# EasyEDA Pro project charging-dock-10.eprj

# Schematic 10 Tracker Charging Dock
Board Name: 10 Tracker Charging Dock; Create Date: 2026-08-09; Page Name: Dock-10; Project Name: charging-dock-10; Schematic Name: 10 Tracker Charging Dock; Update Date: 2026-09-15; Company: puppy sky; Page Size: A4; Version: paw-1
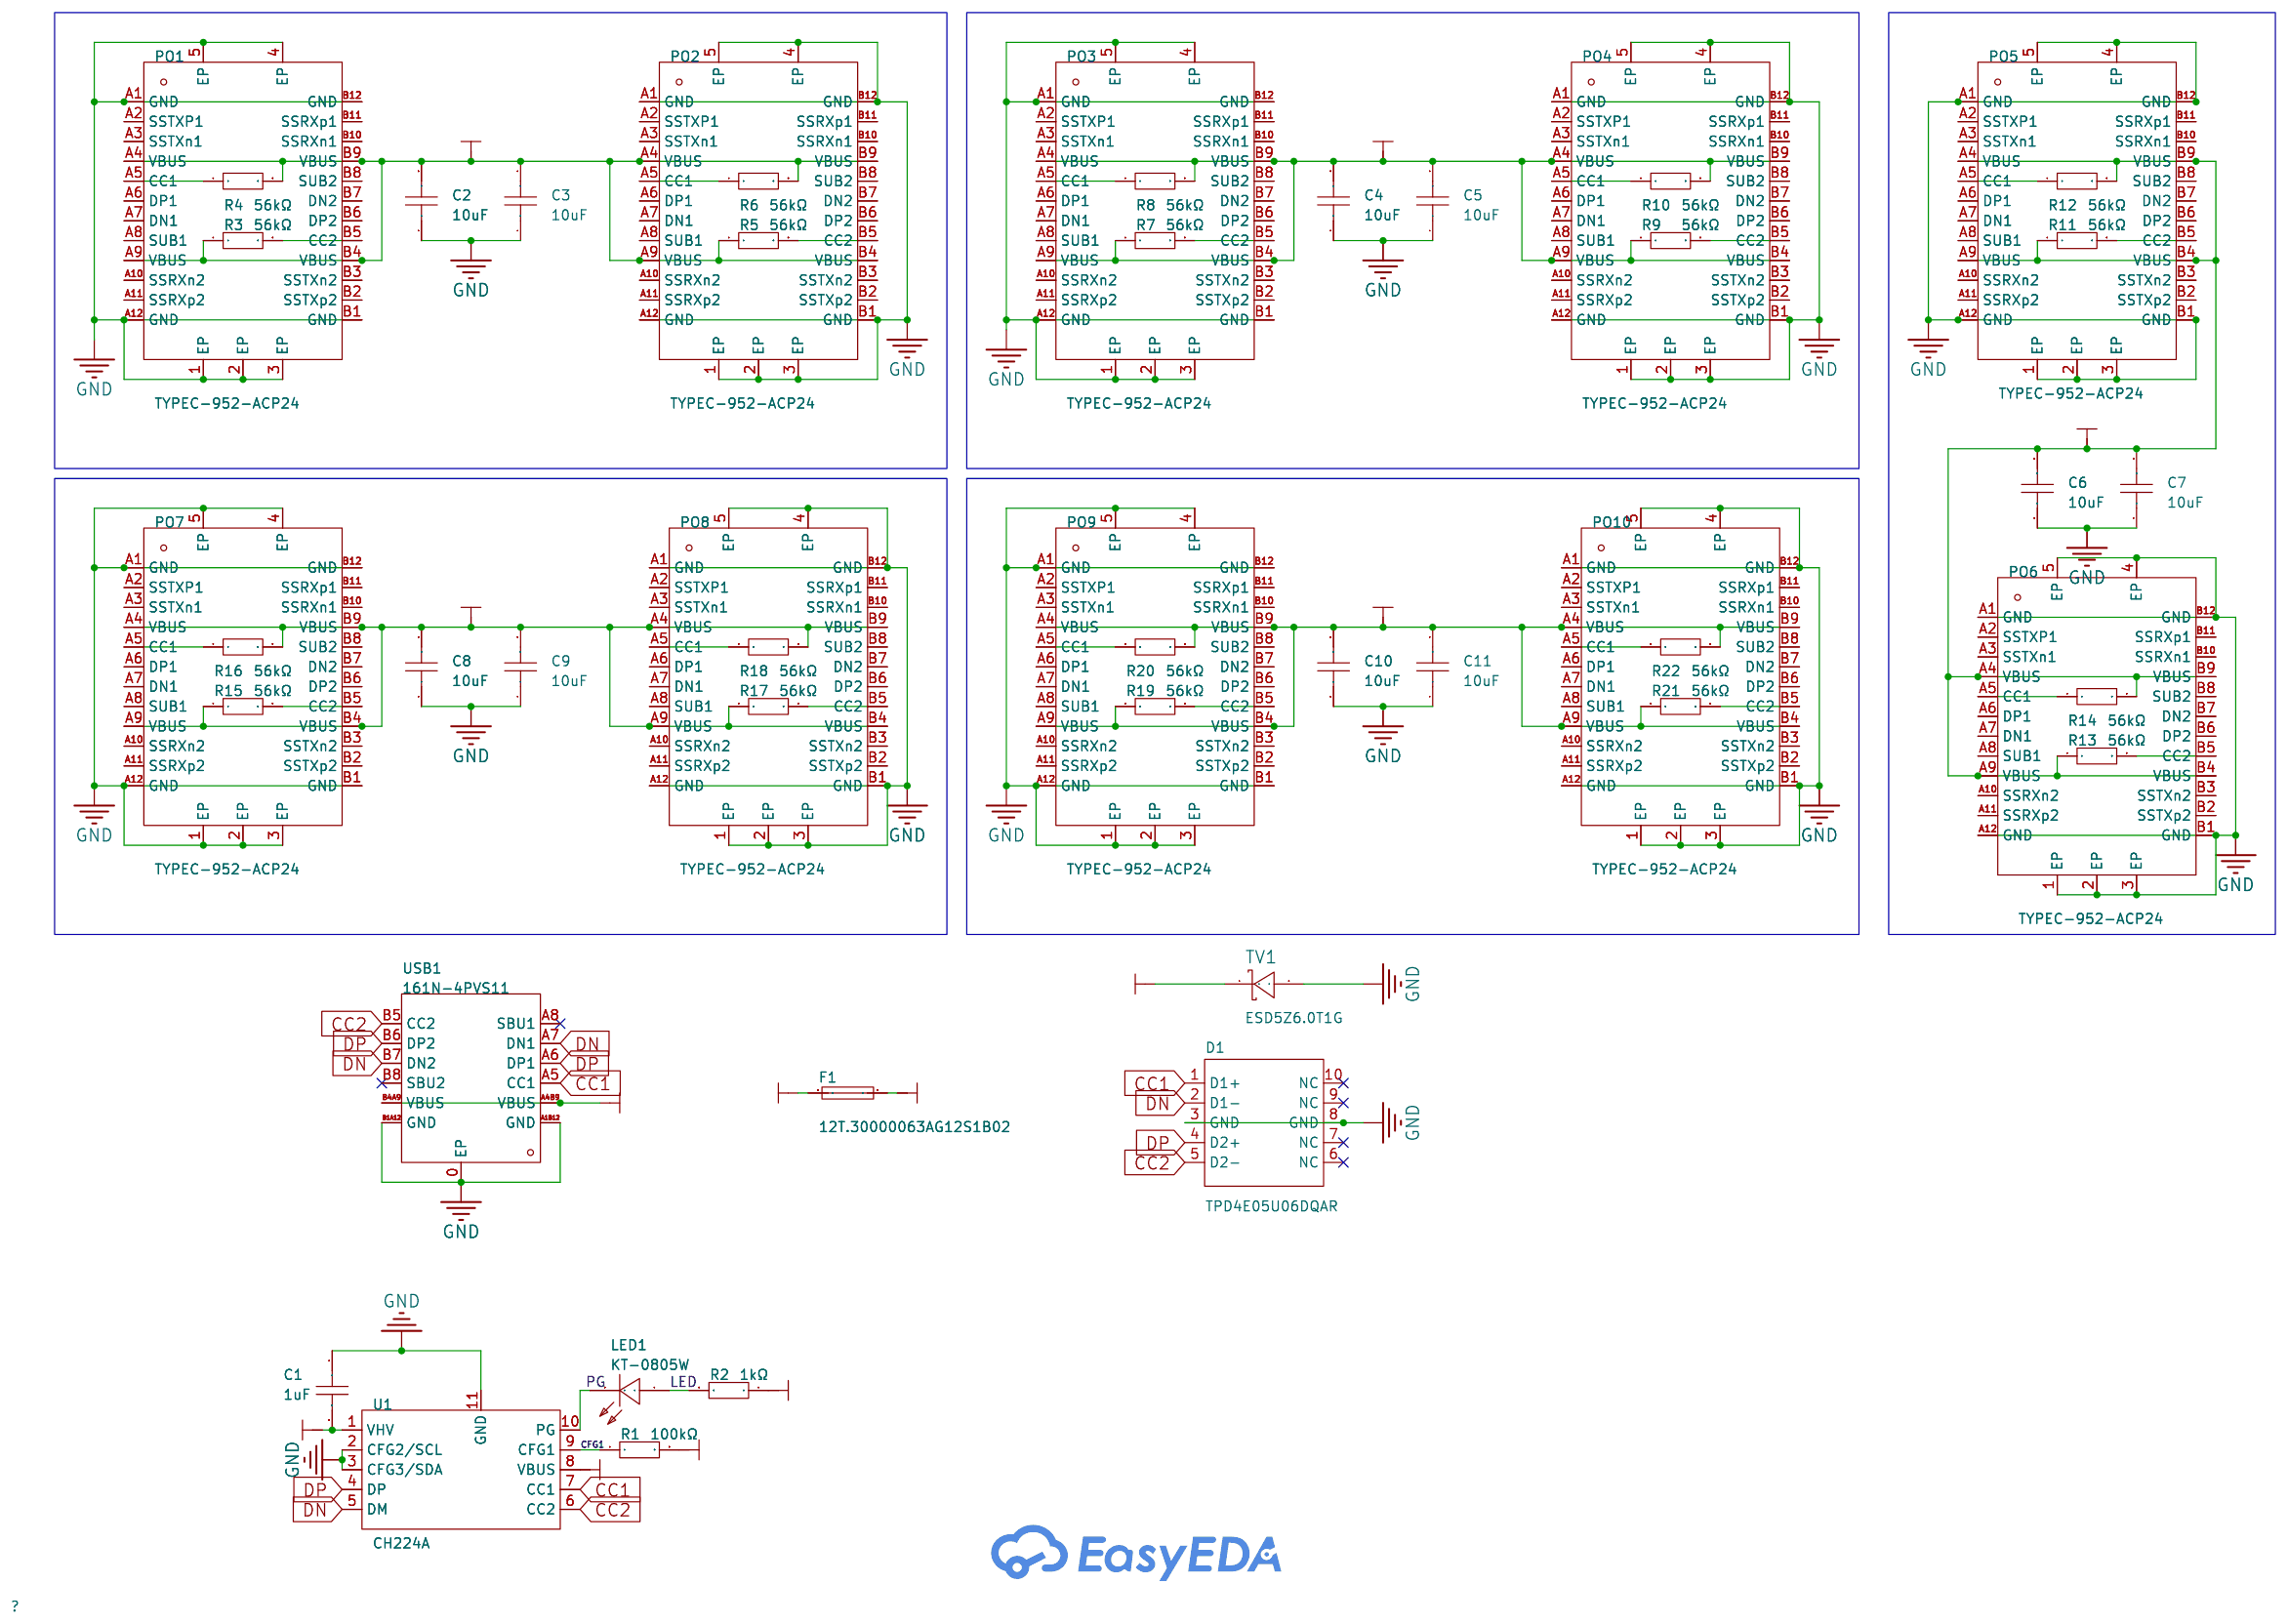
[diagram p0: schematic sheet]

## Parts
C1  1uF  [C0603]
C2  10uF  [C0805]
C3  10uF  [C0805]
C4  10uF  [C0805]
C5  10uF  [C0805]
C6  10uF  [C0805]
C7  10uF  [C0805]
C8  10uF  [C0805]
C9  10uF  [C0805]
C10  10uF  [C0805]
C11  10uF  [C0805]
D1  TPD4E05U06DQAR  [USON-10_L2.5-W1.0-P0.50-BL]
F1  12T.30000063AG12S1B02  [F1206]
LED1  KT-0805W  [LED0805-R-RD]
PO1  TYPEC-952-ACP24  [USB-C-SMD_TYPEC-952-ACP24]
PO2  TYPEC-952-ACP24  [USB-C-SMD_TYPEC-952-ACP24]
PO3  TYPEC-952-ACP24  [USB-C-SMD_TYPEC-952-ACP24]
PO4  TYPEC-952-ACP24  [USB-C-SMD_TYPEC-952-ACP24]
PO5  TYPEC-952-ACP24  [USB-C-SMD_TYPEC-952-ACP24]
PO6  TYPEC-952-ACP24  [USB-C-SMD_TYPEC-952-ACP24]
PO7  TYPEC-952-ACP24  [USB-C-SMD_TYPEC-952-ACP24]
PO8  TYPEC-952-ACP24  [USB-C-SMD_TYPEC-952-ACP24]
PO9  TYPEC-952-ACP24  [USB-C-SMD_TYPEC-952-ACP24]
PO10  TYPEC-952-ACP24  [USB-C-SMD_TYPEC-952-ACP24]
R1  100kΩ  [R0603]
R2  1kΩ  [R0603]
R3  56kΩ  [R0603]
R4  56kΩ  [R0603]
R5  56kΩ  [R0603]
R6  56kΩ  [R0603]
R7  56kΩ  [R0603]
R8  56kΩ  [R0603]
R9  56kΩ  [R0603]
R10  56kΩ  [R0603]
R11  56kΩ  [R0603]
R12  56kΩ  [R0603]
R13  56kΩ  [R0603]
R14  56kΩ  [R0603]
R15  56kΩ  [R0603]
R16  56kΩ  [R0603]
R17  56kΩ  [R0603]
R18  56kΩ  [R0603]
R19  56kΩ  [R0603]
R20  56kΩ  [R0603]
R21  56kΩ  [R0603]
R22  56kΩ  [R0603]
TV1  ESD5Z6.0T1G  [SOD-523F_L1.2-W0.8-LS1.7-RD]
U1  CH224A  [ESSOP-10_L4.9-W3.9-P1.0-LS6.0-TL-EP]
USB1  161N-4PVS11  [USB-C-SMD_HANELECTRICITY_161N-4XVS11]

## Library data of the parts
C1 = CL10A105KB8NNNC: Capacitance: Tolerance:±10% Tolerance:±10% Voltage Rated: Temperature Coefficient:; LCSC Part Name: 1uF ±10% 50V; Supplier Part: C15849; Manufacturer: SAMSUNG(三星); Supplier Footprint: 0603; JLCPCB Part Class: Basic Part; Datasheet: https://atta.szlcsc.com/upload/public/pdf/source/20160218/1457707763339.pdf; Supplier: LCSC; Tolerance: ±10%
C2-C11 = CL21A106KAYNNNE_C15850: Capacitance: Tolerance:±10% Tolerance:±10% Voltage Rated: Temperature Coefficient:; LCSC Part Name: 10uF ±10% 25V; Supplier Part: C15850; Manufacturer: SAMSUNG(三星); Manufacturer Part: CL21A106KAYNNNE; Supplier Footprint: 0805; JLCPCB Part Class: Basic Part; Datasheet: https://atta.szlcsc.com/upload/public/pdf/source/20160218/1457707763339.pdf; Supplier: LCSC; Tolerance: ±10%
D1 = TPD4E05U06DQAR_C138714: LCSC Part Name: 单向TVS 5.5V截止 峰值脉冲电流：2.5A@8/20us; Supplier Part: C138714; Manufacturer: TI(德州仪器); Supplier Footprint: USON-10(1x2.5); JLCPCB Part Class: Extended Part; Datasheet: https://www.ti.com/cn/lit/ds/symlink/tpd4e05u06.pdf; Supplier: LCSC; Polarity: Unidirectional; Reverse Stand-Off Voltage (Vrwm): 5.5V; Clamping Voltage: 14V; Peak Pulse Current (Ipp): 2.5A@8/20us; Peak Pulse Power Dissipation (Ppp): 40W@8/20us; Voltage - Breakdown: 6.5V; Reverse Leakage Current (Ir): 10nA; Number of Channels: Four channels; Operating Temperature: -40℃~+125℃; level of protection: IEC 61000-4-4；IEC 61000-4-5；IEC 61000-4-2; Type: ESD; Junction Capacitance: 0.5pF
F1 = 12T.30000063AG12S1B02: Type:SMD Fuse Current Rating:3A Voltage Rating (DC):63V Operating Temperature:-55℃~+125℃ Operating Temperature:-55℃~+125℃ Interrupt Rating:50A; LCSC Part Name: 贴片式保险丝; Supplier Part: C140478; Manufacturer: xcfuse(旭程); Supplier Footprint: 1206; JLCPCB Part Class: Extended Part; Datasheet: https://atta.szlcsc.com/upload/public/pdf/source/20180423/C140482_0BFCB1E2582598C0CD6C9793BBCA88DB.pdf; Supplier: LCSC; Type: SMD Fuse; Current Rating: 3A; Voltage Rating (DC): 63V; Operating Temperature: -55℃~+125℃; Interrupt Rating: 50A
LED1 = KT-0805W: LCSC Part Name: 0805 白灯 高亮; Supplier Part: C34499; Manufacturer: KENTO; Supplier Footprint: 0805; JLCPCB Part Class: Basic Part; Datasheet: https://atta.szlcsc.com/upload/public/pdf/source/20221124/DAA20402FFC1FB071B8B6797757426FE.pdf; Supplier: LCSC
PO1-PO10 = TYPEC-952-ACP24: Connector Type:Type-C Protocol Standard:USB 3.1 Gender:Male Mounting Type:Surface Mount,Vertical Number of Contacts:24P Number of Ports:1 Current Rating-Power:5A Voltage Rating:5V Connect-Disconnect Life:10000 times Length:11.1mm Detection color:Black Ope; LCSC Part Name: Type-C 公 立贴; Supplier Part: C2840398; Manufacturer: XUNPU(讯普); Supplier Footprint: SMD; JLCPCB Part Class: Extended Part; Datasheet: https://item.szlcsc.com/datasheet/TYPEC-952-ACP24/3018861.html; Supplier: LCSC; Connector Type: Type-C; Protocol Standard: USB 3.1; Gender: Male; Mounting Type: Surface Mount,Vertical; Number of Contacts: 24P; Number of Ports: 1; Current Rating-Power: 5A; Voltage Rating: 5V; Connect-Disconnect Life: 10000 times; Length: 11.1mm; Detection color: Black; Operating Temperature: -45℃~+85℃
R1 = 0603WAF1003T5E: Type:Thick Film Resistor Resistance:100kΩ Tolerance:±1% Tolerance:±1% Power(Watts):100mW Voltage-Supply(Max):75V Temperature Coefficient:±100ppm/℃ Temperature Coefficient:±100ppm/℃ Operating Temperature:-55℃~+155℃ Operating Temperature:-55℃~+155℃; LCSC Part Name: 厚膜电阻 100kΩ ±1%; Supplier Part: C25803; Manufacturer: UNI-ROYAL(厚声); Supplier Footprint: 0603; JLCPCB Part Class: Basic Part; Datasheet: https://item.szlcsc.com/datasheet/0603WAF1003T5E/26546.html; Supplier: LCSC; Type: Thick Film Resistor; Tolerance: ±1%; Power(Watts): 100mW; Voltage-Supply(Max): 75V; Temperature Coefficient: ±100ppm/℃; Operating Temperature: -55℃~+155℃
R2 = 0603WAF1001T5E: Type:Thick Film Resistors Resistance:1kΩ Tolerance:±1% Tolerance:±1% Power(Watts): Overload Voltage (Max): Temperature Coefficient:±100ppm/℃ Temperature Coefficient:±100ppm/℃ Operating Temperature Range:-55℃~+155℃ Operating Temperature Range:-55℃~+155℃; LCSC Part Name: 1kΩ ±1% 100mW 厚膜电阻; Supplier Part: C21190; Manufacturer: UNI-ROYAL(厚声); Supplier Footprint: 0603; JLCPCB Part Class: Basic Part; Datasheet: https://atta.szlcsc.com/upload/public/pdf/source/20200306/C422600_1E6D84923E4A46A82E41ADD87F860B5C.pdf; Supplier: LCSC; Type: Thick Film Resistors; Tolerance: ±1%; Temperature Coefficient: ±100ppm/℃; Operating Temperature Range: -55℃~+155℃
R3-R22 = 0603WAF5602T5E: Type:Thick Film Resistor Resistance:56kΩ Tolerance:±1% Tolerance:±1% Power(Watts):100mW Voltage-Supply(Max):75V Temperature Coefficient:±100ppm/℃ Temperature Coefficient:±100ppm/℃ Operating Temperature:-55℃~+155℃ Operating Temperature:-55℃~+155℃; LCSC Part Name: 56kΩ ±1% 100mW 厚膜电阻; Supplier Part: C23206; Manufacturer: UNI-ROYAL(厚声); Supplier Footprint: 0603; JLCPCB Part Class: Basic Part; Datasheet: https://item.szlcsc.com/datasheet/0603WAF5602T5E/23933.html; Supplier: LCSC; Type: Thick Film Resistor; Tolerance: ±1%; Power(Watts): 100mW; Voltage-Supply(Max): 75V; Temperature Coefficient: ±100ppm/℃; Operating Temperature: -55℃~+155℃
TV1 = ESD5Z6.0T1G: LCSC Part Name: 单向ESD 6V截止 峰值脉冲电流：8.8A; Supplier Part: C82323; Manufacturer: onsemi(安森美); Supplier Footprint: SOD-523; JLCPCB Part Class: Extended Part; Datasheet: https://item.szlcsc.com/datasheet/ESD5Z6.0T1G/83480.html; Supplier: LCSC; Polarity: Unidirectional; Reverse Stand-Off Voltage (Vrwm): 6V; Clamping Voltage: 12.4V; Peak Pulse Current (Ipp): 8.8A; Peak Pulse Power Dissipation (Ppp): 181W@8/20us; Voltage - Breakdown: 6.8V; Reverse Leakage Current (Ir): 10nA; Number of Channels: 1; Operating Temperature: -55℃~+150℃; level of protection: IEC 61000-4-4；IEC 61000-4-2; Type: ESD; Junction Capacitance: 70pF
U1 = CH224A: Type:Power Receiver Controller Output Power:140W Output Voltage:5V；20V；15V；12V；28V；9V Operating Temperature:-40℃~+105℃ Operating Temperature:-40℃~+105℃; Supplier Part: C42459160; Manufacturer: WCH(南京沁恒); Supplier Footprint: ESSOP-10; JLCPCB Part Class: Extended Part; Datasheet: https://item.szlcsc.com/datasheet/CH224A/44538670.html; Supplier: LCSC; Type: Power Receiver Controller; Output Power: 140W; Output Voltage: 5V；20V；15V；12V；28V；9V; Operating Temperature: -40℃~+105℃
USB1 = 161N-4PVS11: LCSC Part Name: Type-C 母 卧贴; Supplier Part: C5440757; Manufacturer: HanElectricity(瀚源); Supplier Footprint: 插件; JLCPCB Part Class: Extended Part; Datasheet: https://item.szlcsc.com/datasheet/161N-4PVS11/6323622.html; Supplier: LCSC; Connector Type: Type-C; Gender: Female; Mounting Type: Surface Mount, Right Angle; Number of Contacts: 16P; Number of Ports: 1; Current Rating-Power: 3A; Connect-Disconnect Life: 10,000 cycles; Length: 7.3mm; Detection color: Purple; Operating Temperature: -55℃~+85℃

## Nets
GND: C1.1 C2.1 C3.1 C4.1 C5.1 C6.1 C7.1 C8.1 C9.1 C10.1 C11.1 D1.3(GND) D1.8(GND) PO1.1(EP) PO1.2(EP) PO1.3(EP) PO1.4(EP) PO1.5(EP) PO1.A1(GND) PO1.A12(GND) PO1.B1(GND) PO1.B12(GND) PO2.1(EP) PO2.2(EP) PO2.3(EP) PO2.4(EP) PO2.5(EP) PO2.A1(GND) PO2.A12(GND) PO2.B1(GND) PO2.B12(GND) PO3.1(EP) PO3.2(EP) PO3.3(EP) PO3.4(EP) PO3.5(EP) PO3.A1(GND) PO3.A12(GND) PO3.B1(GND) PO3.B12(GND) PO4.1(EP) PO4.2(EP) PO4.3(EP) PO4.4(EP) PO4.5(EP) PO4.A1(GND) PO4.A12(GND) PO4.B1(GND) PO4.B12(GND) PO5.1(EP) PO5.2(EP) PO5.3(EP) PO5.4(EP) PO5.5(EP) PO5.A1(GND) PO5.A12(GND) PO5.B1(GND) PO5.B12(GND) PO6.1(EP) PO6.2(EP) PO6.3(EP) PO6.4(EP) PO6.5(EP) PO6.A1(GND) PO6.A12(GND) PO6.B1(GND) PO6.B12(GND) PO7.1(EP) PO7.2(EP) PO7.3(EP) PO7.4(EP) PO7.5(EP) PO7.A1(GND) PO7.A12(GND) PO7.B1(GND) PO7.B12(GND) PO8.1(EP) PO8.2(EP) PO8.3(EP) PO8.4(EP) PO8.5(EP) PO8.A1(GND) PO8.A12(GND) PO8.B1(GND) PO8.B12(GND) PO9.1(EP) PO9.2(EP) PO9.3(EP) PO9.4(EP) PO9.5(EP) PO9.A1(GND) PO9.A12(GND) PO9.B1(GND) PO9.B12(GND) PO10.1(EP) PO10.2(EP) PO10.3(EP) PO10.4(EP) PO10.5(EP) PO10.A1(GND) PO10.A12(GND) PO10.B1(GND) PO10.B12(GND) TV1.2(A) U1.2(CFG2/SCL) U1.3(CFG3/SDA) U1.11(GND) USB1.0(EP) USB1.A1B12(GND) USB1.B1A12(GND)
PVBUS: C1.2 C2.2 C3.2 C4.2 C5.2 C6.2 C7.2 C8.2 C9.2 C10.2 C11.2 F1.1 PO1.A4(VBUS) PO1.A9(VBUS) PO1.B4(VBUS) PO1.B9(VBUS) PO2.A4(VBUS) PO2.A9(VBUS) PO2.B4(VBUS) PO2.B9(VBUS) PO3.A4(VBUS) PO3.A9(VBUS) PO3.B4(VBUS) PO3.B9(VBUS) PO4.A4(VBUS) PO4.A9(VBUS) PO4.B4(VBUS) PO4.B9(VBUS) PO5.A4(VBUS) PO5.A9(VBUS) PO5.B4(VBUS) PO5.B9(VBUS) PO6.A4(VBUS) PO6.A9(VBUS) PO6.B4(VBUS) PO6.B9(VBUS) PO7.A4(VBUS) PO7.A9(VBUS) PO7.B4(VBUS) PO7.B9(VBUS) PO8.A4(VBUS) PO8.A9(VBUS) PO8.B4(VBUS) PO8.B9(VBUS) PO9.A4(VBUS) PO9.A9(VBUS) PO9.B4(VBUS) PO9.B9(VBUS) PO10.A4(VBUS) PO10.A9(VBUS) PO10.B4(VBUS) PO10.B9(VBUS) R1.2 R2.1 R3.1 R4.2 R5.1 R6.2 R7.1 R8.2 R9.1 R10.2 R11.1 R12.2 R13.1 R14.2 R15.1 R16.2 R17.1 R18.2 R19.1 R20.2 R21.1 R22.2 TV1.1(K) U1.1(VHV) U1.8(VBUS)
VBUS: F1.2 USB1.A4B9(VBUS) USB1.B4A9(VBUS)
CC1: D1.1(D1+) U1.7(CC1) USB1.A5(CC1)
CC2: D1.5(D2-) U1.6(CC2) USB1.B5(CC2)
CFG1: R1.1 U1.9(CFG1)
DN: D1.2(D1-) U1.5(DM) USB1.A7(DN1) USB1.B7(DN2)
DP: D1.4(D2+) U1.4(DP) USB1.A6(DP1) USB1.B6(DP2)
LED: LED1.1(A) R2.2
PG: LED1.2(K) U1.10(PG)
$1N16517: PO1.B5(CC2) R3.2
$1N16677: PO1.A5(CC1) R4.1
$1N16819: PO2.A5(CC1) R6.1
$1N16821: PO2.B5(CC2) R5.2
$1N16918: PO3.A5(CC1) R8.1
$1N16920: PO3.B5(CC2) R7.2
$1N17013: PO4.A5(CC1) R10.1
$1N17015: PO4.B5(CC2) R9.2
$1N17112: PO5.A5(CC1) R12.1
$1N17114: PO5.B5(CC2) R11.2
$1N17209: PO6.A5(CC1) R14.1
$1N17211: PO6.B5(CC2) R13.2
$1N17310: PO7.A5(CC1) R16.1
$1N17312: PO7.B5(CC2) R15.2
$1N17405: PO8.A5(CC1) R18.1
$1N17407: PO8.B5(CC2) R17.2
$1N17504: PO9.A5(CC1) R20.1
$1N17506: PO9.B5(CC2) R19.2
$1N17599: PO10.A5(CC1) R22.1
$1N17601: PO10.B5(CC2) R21.2

Not connected (* = marked no-connect by the designer): D1 6(NC)* 7(NC)* 9(NC)* 10(NC)*; PO1 A2(SSTXP1) A3(SSTXn1) A6(DP1) A7(DN1) A8(SUB1) A10(SSRXn2) A11(SSRXp2) B2(SSTXp2) B3(SSTXn2) B6(DP2) B7(DN2) B8(SUB2) B10(SSRXn1) B11(SSRXp1); PO2 A2(SSTXP1) A3(SSTXn1) A6(DP1) A7(DN1) A8(SUB1) A10(SSRXn2) A11(SSRXp2) B2(SSTXp2) B3(SSTXn2) B6(DP2) B7(DN2) B8(SUB2) B10(SSRXn1) B11(SSRXp1); PO3 A2(SSTXP1) A3(SSTXn1) A6(DP1) A7(DN1) A8(SUB1) A10(SSRXn2) A11(SSRXp2) B2(SSTXp2) B3(SSTXn2) B6(DP2) B7(DN2) B8(SUB2) B10(SSRXn1) B11(SSRXp1); PO4 A2(SSTXP1) A3(SSTXn1) A6(DP1) A7(DN1) A8(SUB1) A10(SSRXn2) A11(SSRXp2) B2(SSTXp2) B3(SSTXn2) B6(DP2) B7(DN2) B8(SUB2) B10(SSRXn1) B11(SSRXp1); PO5 A2(SSTXP1) A3(SSTXn1) A6(DP1) A7(DN1) A8(SUB1) A10(SSRXn2) A11(SSRXp2) B2(SSTXp2) B3(SSTXn2) B6(DP2) B7(DN2) B8(SUB2) B10(SSRXn1) B11(SSRXp1); PO6 A2(SSTXP1) A3(SSTXn1) A6(DP1) A7(DN1) A8(SUB1) A10(SSRXn2) A11(SSRXp2) B2(SSTXp2) B3(SSTXn2) B6(DP2) B7(DN2) B8(SUB2) B10(SSRXn1) B11(SSRXp1); PO7 A2(SSTXP1) A3(SSTXn1) A6(DP1) A7(DN1) A8(SUB1) A10(SSRXn2) A11(SSRXp2) B2(SSTXp2) B3(SSTXn2) B6(DP2) B7(DN2) B8(SUB2) B10(SSRXn1) B11(SSRXp1); PO8 A2(SSTXP1) A3(SSTXn1) A6(DP1) A7(DN1) A8(SUB1) A10(SSRXn2) A11(SSRXp2) B2(SSTXp2) B3(SSTXn2) B6(DP2) B7(DN2) B8(SUB2) B10(SSRXn1) B11(SSRXp1); PO9 A2(SSTXP1) A3(SSTXn1) A6(DP1) A7(DN1) A8(SUB1) A10(SSRXn2) A11(SSRXp2) B2(SSTXp2) B3(SSTXn2) B6(DP2) B7(DN2) B8(SUB2) B10(SSRXn1) B11(SSRXp1); PO10 A2(SSTXP1) A3(SSTXn1) A6(DP1) A7(DN1) A8(SUB1) A10(SSRXn2) A11(SSRXp2) B2(SSTXp2) B3(SSTXn2) B6(DP2) B7(DN2) B8(SUB2) B10(SSRXn1) B11(SSRXp1); USB1 A8(SBU1)* B8(SBU2)*

# Board 10 Tracker Charging Dock
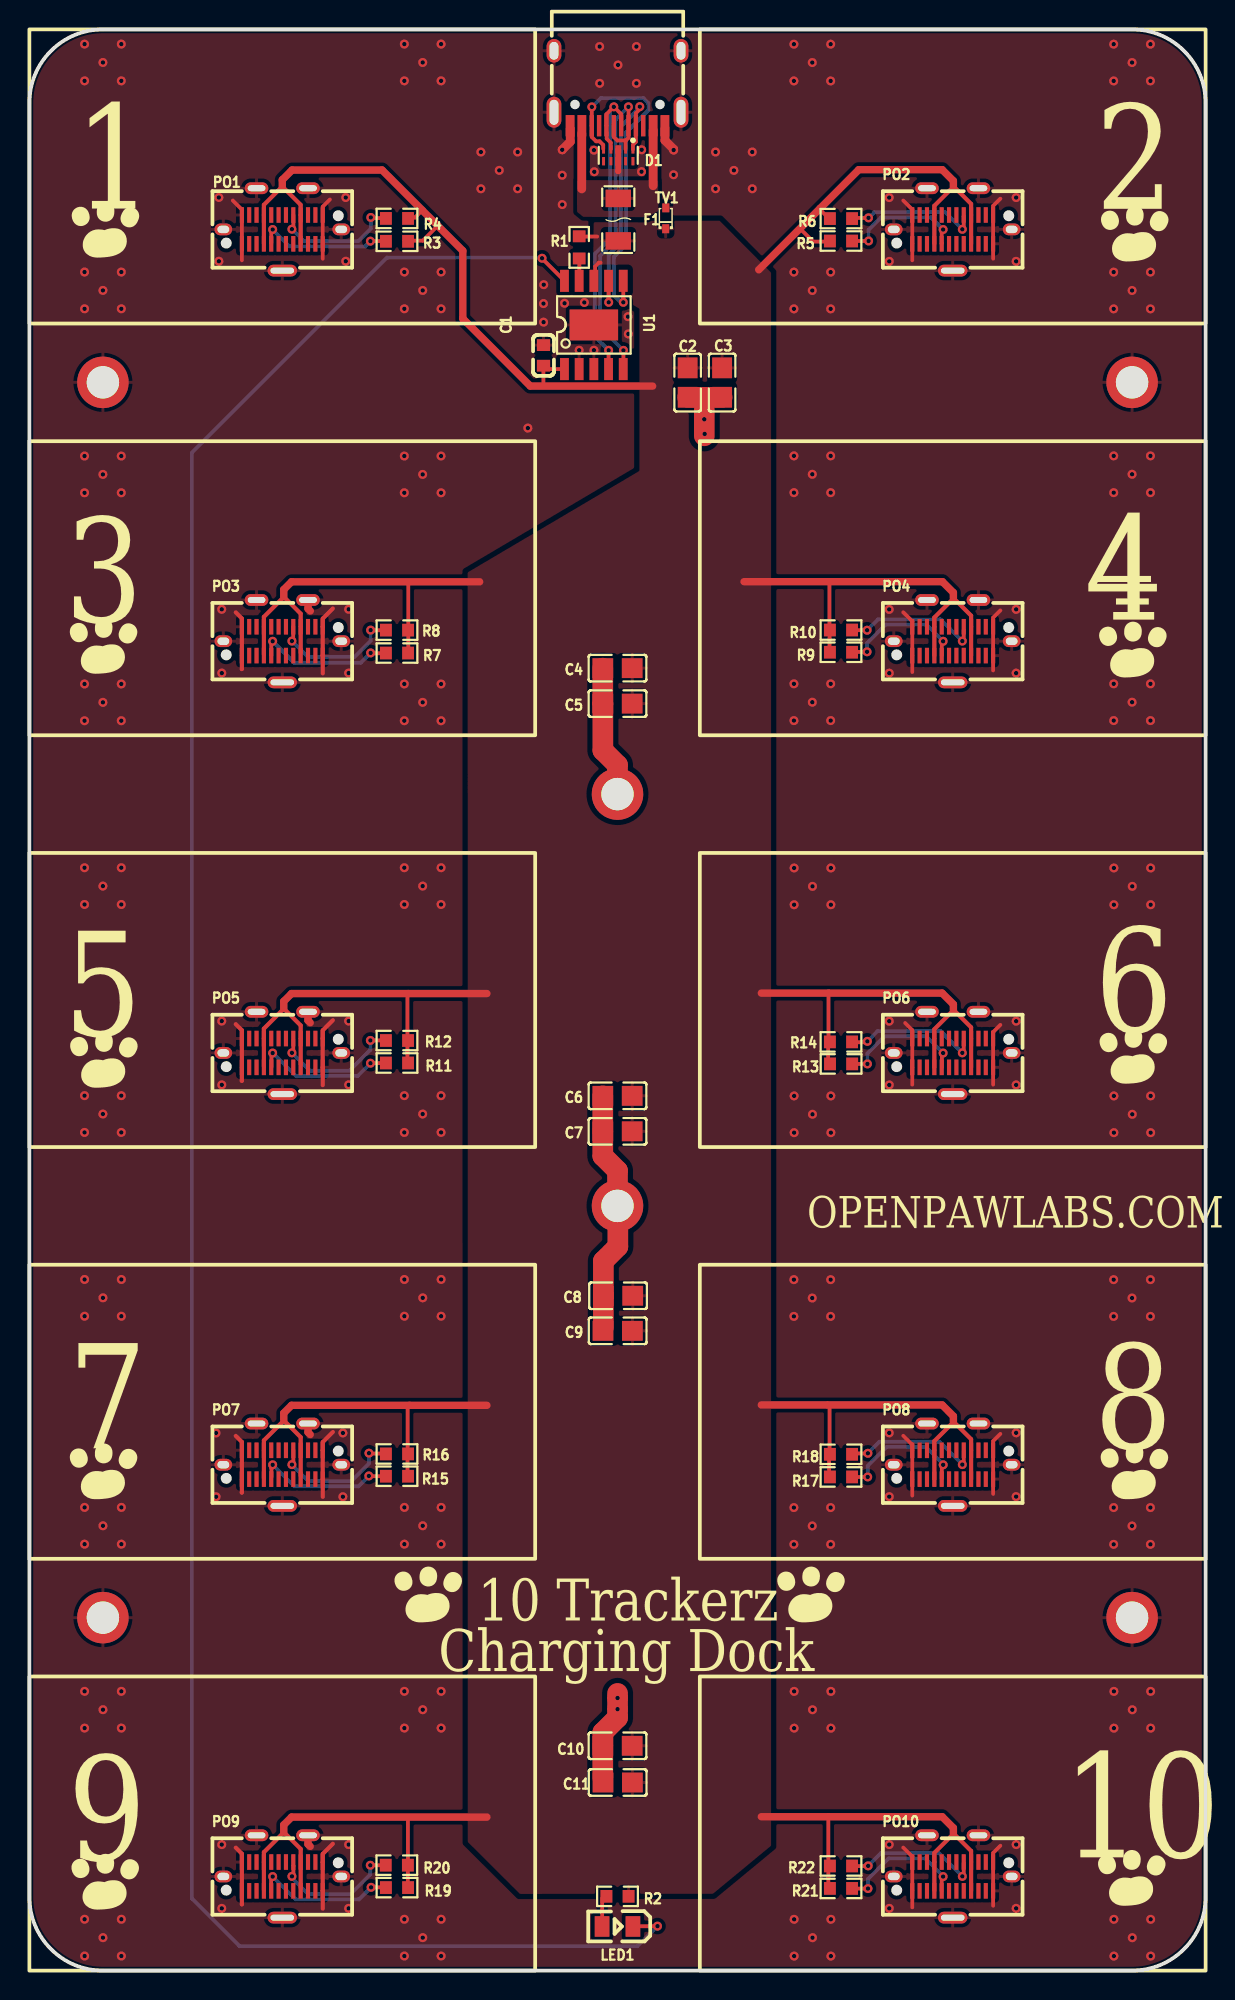
[diagram p1: board, top side]
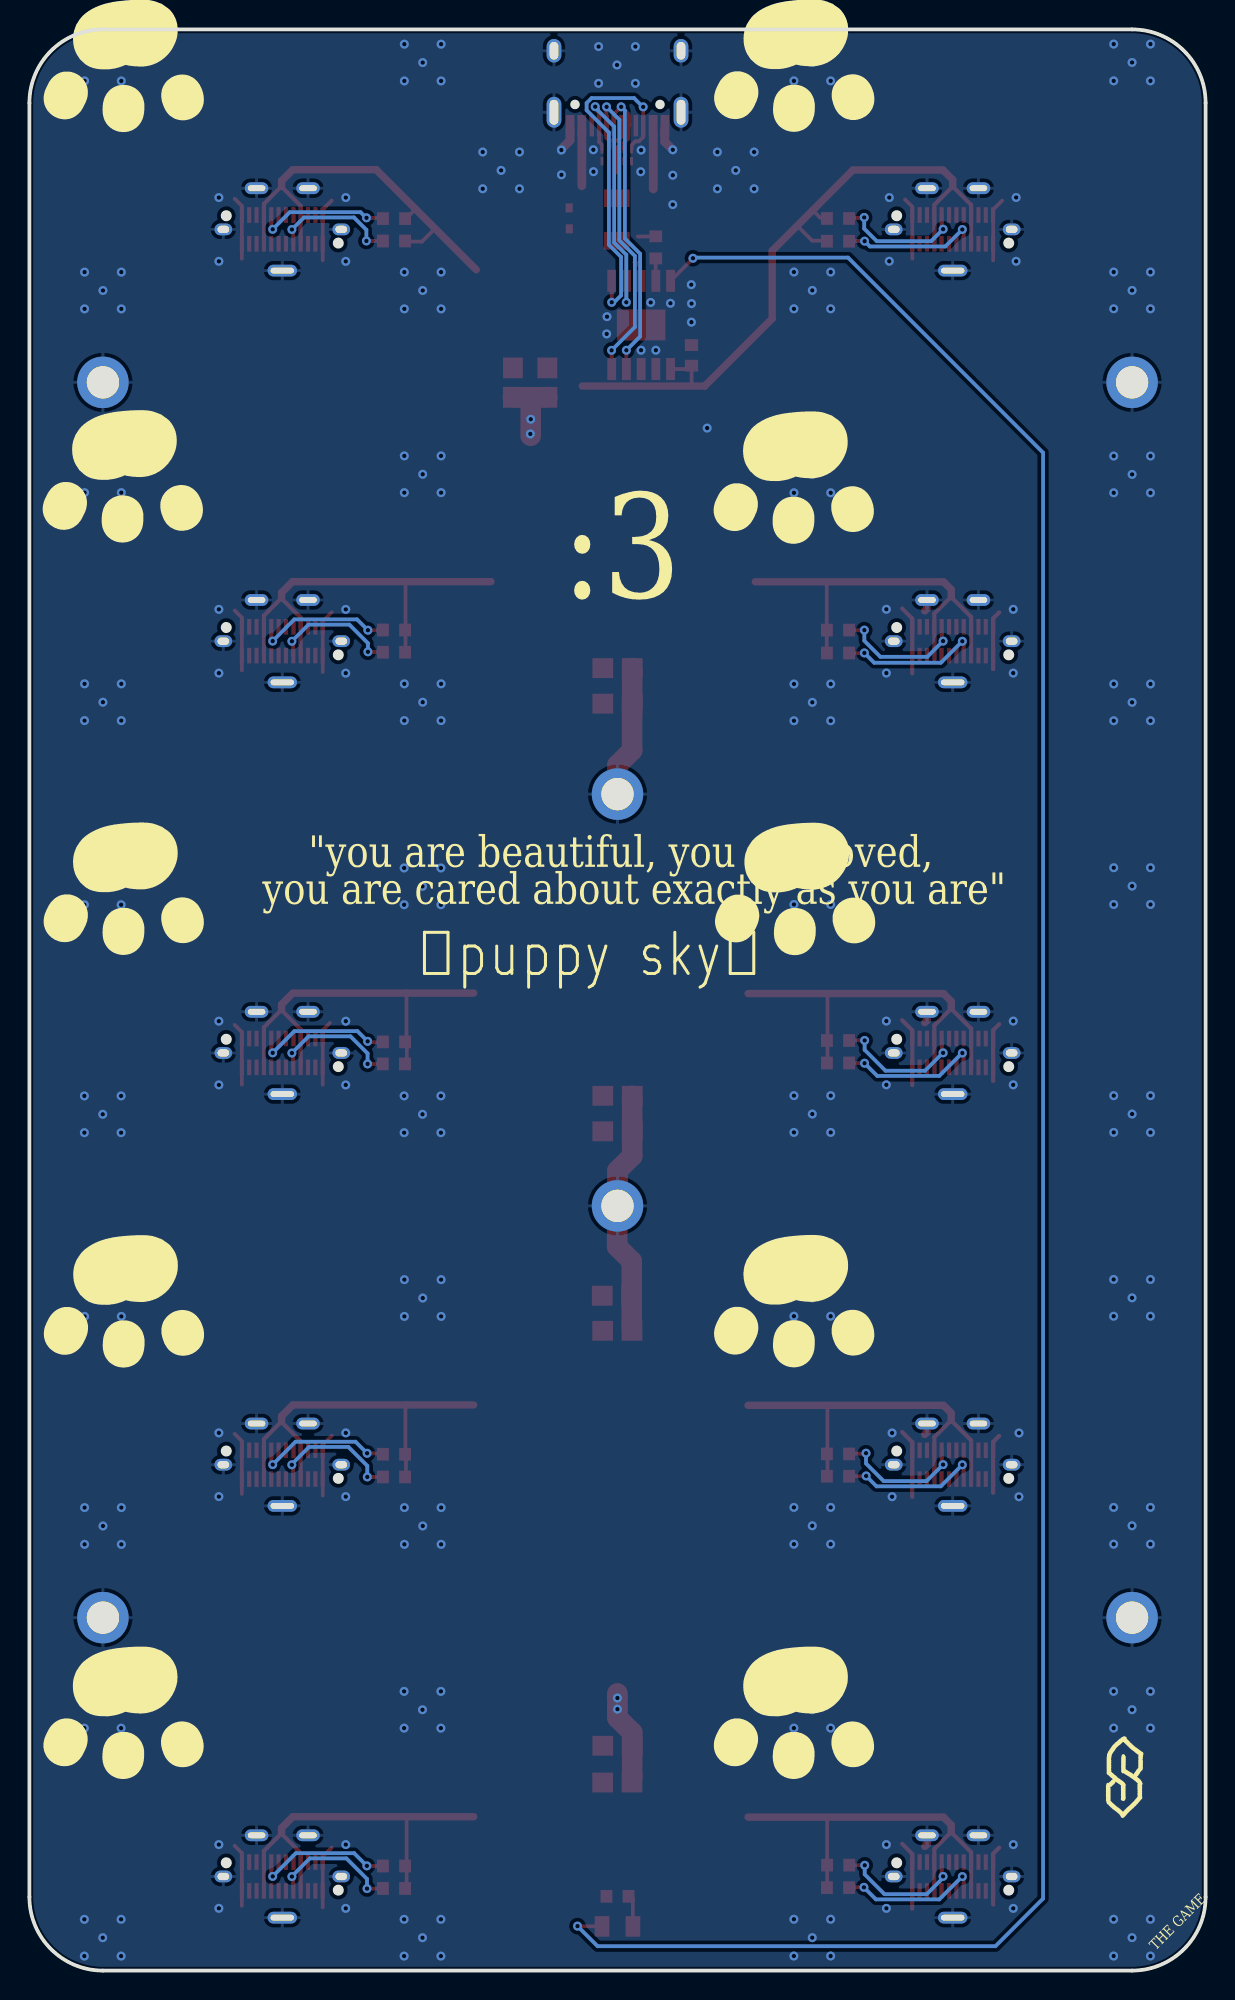
[diagram p2: board, bottom side, seen from below]

Outline 80 x 132 mm; copper layers: Top Layer, Bottom Layer. Coordinates in mm from the lower left corner of the outline.
Outline path: 0,127 0,5 arc(1.46,1.46) 5,0 75,0 arc(78.54,1.46) 80,5 80,127 arc(78.54,130.54) 75,132 5,132 arc(1.46,130.54) 0,127
Stack: Top Layer 0.035mm / Dielectric1 1.51mm FR4 er 4.5 / Bottom Layer 0.035mm

## Design rules (mm)
template: JLCPCB Capability(Two Layers Board)
spacing copperThickness1oz (default): track to track 0.102, other pairs 0.152 to 0.3
spacing copperThickness2oz: track to track 0.203, other pairs 0.152 to 0.3
track width copperThickness1oz (default): min 0.127, default 0.254, max 2.54
track width copperThickness2oz: min 0.203, default 0.254, max 2.54
differential pair differentialPair (default): width min 0.127, default 0.254, max 2.54; gap min 0.152, default 0.152
via viaSize (default): diameter min 0.5, default 0.61, max 10; hole min 0.3, default 0.305, max 6.3

## Placement (name value [footprint] x y rotation side)
C1  1uF  [C0603]  34.97 109.83 270 top
C2  10uF  [C0805]  44.77 107.98 90 top
C3  10uF  [C0805]  47.12 107.98 90 top
C4  10uF  [C0805]  40 88.57 0 top
C5  10uF  [C0805]  40 86.15 0 top
C6  10uF  [C0805]  40 59.48 0 top
C7  10uF  [C0805]  40 57.07 0 top
C8  10uF  [C0805]  40.04 45.89 0 top
C9  10uF  [C0805]  40.01 43.5 0 top
C10  10uF  [C0805]  40 15.29 0 top
C11  10uF  [C0805]  40.01 12.79 0 top
D1  TPD4E05U06DQAR  [USON-10_L2.5-W1.0-P0.50-BL]  40.05 123.44 180 top
F1  12T.30000063AG12S1B02  [F1206]  40.05 119.06 90 top
LED1  KT-0805W  [LED0805-R-RD]  40 3 180 top
NOREF  -  [Pad_e844]  40 80 0 top
NOREF#2  -  [Pad_e842]  5 24 0 top
NOREF#3  -  [Pad_e845]  40 52 0 top
NOREF#4  -  [Pad_e843]  75 24 0 top
NOREF#5  -  [Pad_e839]  5 108 0 top
NOREF#6  -  [Pad_e841]  75 108 0 top
PO1  TYPEC-952-ACP24  [USB-C-SMD_TYPEC-952-ACP24]  17.2 118.4 0 top
PO2  TYPEC-952-ACP24  [USB-C-SMD_TYPEC-952-ACP24]  62.8 118.4 0 top
PO3  TYPEC-952-ACP24  [USB-C-SMD_TYPEC-952-ACP24]  17.2 90.4 0 top
PO4  TYPEC-952-ACP24  [USB-C-SMD_TYPEC-952-ACP24]  62.8 90.4 0 top
PO5  TYPEC-952-ACP24  [USB-C-SMD_TYPEC-952-ACP24]  17.2 62.4 0 top
PO6  TYPEC-952-ACP24  [USB-C-SMD_TYPEC-952-ACP24]  62.8 62.4 0 top
PO7  TYPEC-952-ACP24  [USB-C-SMD_TYPEC-952-ACP24]  17.2 34.4 0 top
PO8  TYPEC-952-ACP24  [USB-C-SMD_TYPEC-952-ACP24]  62.8 34.4 0 top
PO9  TYPEC-952-ACP24  [USB-C-SMD_TYPEC-952-ACP24]  17.2 6.4 0 top
PO10  TYPEC-952-ACP24  [USB-C-SMD_TYPEC-952-ACP24]  62.8 6.4 0 top
R1  100kΩ  [R0603]  37.39 117.18 90 top
R2  1kΩ  [R0603]  40 5.05 180 top
R3  56kΩ  [R0603]  25 117.59 180 top
R4  56kΩ  [R0603]  25 119.15 0 top
R5  56kΩ  [R0603]  55.2 117.61 0 top
R6  56kΩ  [R0603]  55.2 119.14 180 top
R7  56kΩ  [R0603]  25 89.59 180 top
R8  56kΩ  [R0603]  25 91.15 0 top
R9  56kΩ  [R0603]  55.2 89.65 0 top
R10  56kΩ  [R0603]  55.2 91.16 180 top
R11  56kΩ  [R0603]  25 61.72 180 top
R12  56kΩ  [R0603]  25 63.24 0 top
R13  56kΩ  [R0603]  55.21 61.66 0 top
R14  56kΩ  [R0603]  55.2 63.15 180 top
R15  56kΩ  [R0603]  25 33.62 180 top
R16  56kΩ  [R0603]  25 35.13 0 top
R17  56kΩ  [R0603]  55.2 33.57 0 top
R18  56kΩ  [R0603]  55.2 35.11 180 top
R19  56kΩ  [R0603]  25 5.64 180 top
R20  56kΩ  [R0603]  24.99 7.17 0 top
R21  56kΩ  [R0603]  55.2 5.59 0 top
R22  56kΩ  [R0603]  55.2 7.11 180 top
TV1  ESD5Z6.0T1G  [SOD-523F_L1.2-W0.8-LS1.7-RD]  43.28 119.16 90 top
U1  CH224A  [ESSOP-10_L4.9-W3.9-P1.0-LS6.0-TL-EP]  38.39 111.9 0 top
USB1  161N-4PVS11  [USB-C-SMD_HANELECTRICITY_161N-4XVS11]  40 128 180 top

## Footprints (pads in the part's own frame, mm; a bottom-side part is the same pattern mirrored in y, then rotated)
C0603
  rect 0.8x0.9 smd: 1(-0.7,0) 2(0.7,0)
C0805
  rect 1.41x1.35 smd: 1(-1,0) 2(1,0)
ESSOP-10_L4.9-W3.9-P1.0-LS6.0-TL-EP
  rect 0.6x1.5 smd: 1(-2,-3) 2(-1,-3) 3(0,-3) 4(1,-3) 5(2,-3) 6(2,3) 7(1,3) 8(0,3) 9(-1,3) 10(-2,3)
  rect 3.3x2.1 smd: 11(0,0)
F1206
  rect 1.19x1.728 smd: 1(-1.445,0) 2(1.445,0)
LED0805-R-RD
  rect 1x1.399 smd: 1(1.05,0) 2(-1.05,0)
Pad_e839
  round 3.5 hole 2.2: 1(0,0)
Pad_e841
  round 3.5 hole 2.2: 1(0,0)
Pad_e842
  round 3.5 hole 2.2: 1(0,0)
Pad_e843
  round 3.5 hole 2.2: 1(0,0)
Pad_e844
  round 3.5 hole 2.2: 1(0,0)
Pad_e845
  round 3.5 hole 2.2: 1(0,0)
R0603
  rect 0.806x0.864 smd: 1(-0.753,0) 2(0.753,0)
SOD-523F_L1.2-W0.8-LS1.7-RD
  custom 0.609x0.483 smd: 1(-0.711,0.005) 2(0.711,-0.005)
USB-C-SMD_HANELECTRICITY_161N-4XVS11
  oval 1x2.1 hole 0.6x1.7: 0(-4.32,1.633) 0(4.32,1.633)
  oval 1x1.6 hole 0.6x1.2: 0(-4.32,-2.547) 0(4.32,-2.547)
  rect 0.6x1.45 smd: A1B12(-3.225,2.547) A4B9(-2.425,2.547) B1A12(3.225,2.547) B4A9(2.425,2.547)
  rect 0.3x1.45 smd: A5(-1.25,2.547) A6(-0.25,2.547) A7(0.25,2.547) A8(1.25,2.547) B5(1.75,2.547) B6(0.75,2.547) B7(-0.75,2.547) B8(-1.75,2.547)
USB-C-SMD_TYPEC-952-ACP24
  oval 1.6x0.8 hole 1.2x0.4: 1(-1.75,2.8) 2(1.75,2.8)
  oval 1.2x0.8 hole 0.8x0.5: 3(4.01,0) 5(-4.01,0)
  oval 2x0.8 hole 1.6x0.4: 4(0,-2.8)
  rect 0.28x1.06 smd: A1(2.75,0.98) A2(2.25,0.98) A3(1.75,0.98) A4(1.25,0.98) A5(0.75,0.98) A6(0.25,0.98) A7(-0.25,0.98) A8(-0.75,0.98) A9(-1.25,0.98) A10(-1.75,0.98) A11(-2.25,0.98) A12(-2.75,0.98) B1(-2.75,-0.98) B2(-2.25,-0.98) B3(-1.75,-0.98) B4(-1.25,-0.98) B5(-0.75,-0.98) B6(-0.25,-0.98) B7(0.25,-0.98) B8(0.75,-0.98) B9(1.25,-0.98) B10(1.75,-0.98) B11(2.25,-0.98) B12(2.75,-0.98)
USON-10_L2.5-W1.0-P0.50-BL
  rect 0.2x0.565 smd: 1(-1,-0.4) 2(-0.5,-0.4) 4(0.5,-0.4) 5(1,-0.4) 6(1,0.4) 7(0.5,0.4) 9(-0.5,0.4) 10(-1,0.4)
  rect 0.4x0.565 smd: 3(0,-0.4) 8(0,0.4)

## Nets
As in the schematic, except:
GND: C1.1 C2.1 C3.1 C4.1 C5.1 C6.1 C7.1 C8.1 C9.1 C10.1 C11.1 D1.3 D1.8 NOREF.1 NOREF#2.1 NOREF#3.1 NOREF#4.1 NOREF#5.1 NOREF#6.1 PO1.1 PO1.2 PO1.3 PO1.4 PO1.5 PO1.A1 PO1.A12 PO1.B1 PO1.B12 PO2.1 PO2.2 PO2.3 PO2.4 PO2.5 PO2.A1 PO2.A12 PO2.B1 PO2.B12 PO3.1 PO3.2 PO3.3 PO3.4 PO3.5 PO3.A1 PO3.A12 PO3.B1 PO3.B12 PO4.1 PO4.2 PO4.3 PO4.4 PO4.5 PO4.A1 PO4.A12 PO4.B1 PO4.B12 PO5.1 PO5.2 PO5.3 PO5.4 PO5.5 PO5.A1 PO5.A12 PO5.B1 PO5.B12 PO6.1 PO6.2 PO6.3 PO6.4 PO6.5 PO6.A1 PO6.A12 PO6.B1 PO6.B12 PO7.1 PO7.2 PO7.3 PO7.4 PO7.5 PO7.A1 PO7.A12 PO7.B1 PO7.B12 PO8.1 PO8.2 PO8.3 PO8.4 PO8.5 PO8.A1 PO8.A12 PO8.B1 PO8.B12 PO9.1 PO9.2 PO9.3 PO9.4 PO9.5 PO9.A1 PO9.A12 PO9.B1 PO9.B12 PO10.1 PO10.2 PO10.3 PO10.4 PO10.5 PO10.A1 PO10.A12 PO10.B1 PO10.B12 TV1.2 U1.2 U1.3 U1.11 USB1.0 USB1.A1B12 USB1.B1A12

Pads without a net: D1 6 7 9 10; PO1 A2 A3 A6 A7 A8 A10 A11 B2 B3 B6 B7 B8 B10 B11; PO2 A2 A3 A6 A7 A8 A10 A11 B2 B3 B6 B7 B8 B10 B11; PO3 A2 A3 A6 A7 A8 A10 A11 B2 B3 B6 B7 B8 B10 B11; PO4 A2 A3 A6 A7 A8 A10 A11 B2 B3 B6 B7 B8 B10 B11; PO5 A2 A3 A6 A7 A8 A10 A11 B2 B3 B6 B7 B8 B10 B11; PO6 A2 A3 A6 A7 A8 A10 A11 B2 B3 B6 B7 B8 B10 B11; PO7 A2 A3 A6 A7 A8 A10 A11 B2 B3 B6 B7 B8 B10 B11; PO8 A2 A3 A6 A7 A8 A10 A11 B2 B3 B6 B7 B8 B10 B11; PO9 A2 A3 A6 A7 A8 A10 A11 B2 B3 B6 B7 B8 B10 B11; PO10 A2 A3 A6 A7 A8 A10 A11 B2 B3 B6 B7 B8 B10 B11; USB1 A8 B8

## Via types
v1: diameter 0.61, hole 0.305, Top Layer to Bottom Layer, 328 vias

## Routing (per net, layer and track width the routed paths; a pad name or vN(x,y) marks a point on that pad's centre or on a via; arc(x,y) is an arc through that point)
GND: length 130.3
  Top Layer w0.254: 59.44,120.36 60.05,119.75 PO2.B1 60.05,116.3 ; 59.44,8.36 60.05,7.75 PO10.B1 60.05,4.3 ; 66.04,8.49 65.55,8 PO10.A1 PO10.B12 65.55,4.41 ; 59.56,64.44 60.05,63.95 PO6.A12 PO6.B1 60.05,60.25 ; 66.04,92.49 65.55,92 PO4.A1 PO4.B12 65.55,88.41 ; 65.55,32.41 PO8.B12 PO8.A1 65.55,36.01 66.04,36.5 ; 66.04,120.49 65.55,120 PO2.A1 PO2.B12 65.55,116.41 ; 59.44,36.37 60.05,35.75 PO8.A12 PO8.B1 60.05,32.31 ; 66.04,64.31 65.55,63.82 PO6.A1 PO6.B12 65.55,60.25 ; 13.84,120.36 14.45,119.75 PO1.B1 14.45,116.3 ; 60.05,88.3 PO4.B1 60.05,91.75 59.44,92.36 ; 19.95,116.41 PO1.B12 PO1.A1 19.95,119.95 20.44,120.44
  Top Layer w0.28: 14.45,88.5 14.45,88.51 14.45,91.94 14.04,92.36 ; 19.95,60.21 19.95,61.42 19.95,61.42 19.95,63.38 19.95,63.38 19.95,63.94 20.64,64.62 ; 19.95,4.21 19.95,5.42 19.95,5.42 19.95,7.38 19.95,7.38 19.95,7.94 20.64,8.62 ; 20.64,36.62 19.95,35.94 19.95,35.38 19.95,35.38 19.95,33.42 19.95,33.42 19.95,32.21 ; 19.95,88.21 19.95,89.42 19.95,89.42 19.95,91.38 19.95,91.38 19.95,91.94 20.64,92.62 ; 14.04,64.36 14.45,63.94 14.45,60.51 14.45,60.5 ; 14.45,4.5 14.45,4.51 14.45,7.94 14.04,8.36 ; 14.04,36.36 14.45,35.94 14.45,32.51 14.45,32.5
  Top Layer w0.4: 40.05,123.8 40.05,122.36 40.05,122.35
  Top Layer w0.5: 19.1,36.45 18.95,36.61 18.95,37.17 ; 18.95,93.17 18.95,92.61 19.1,92.45 ; 19.1,64.46 18.95,64.61 18.95,65.18 ; 19.1,8.44 18.95,8.6 18.95,9.16
  Top Layer w0.6: v1(43.82,123.8) 43.82,123.86 43.23,124.45 43.23,125.28 ; 36.79,125.24 36.79,124.36 v1(36.24,123.81)
  Top Layer w1.4: NOREF#3.1 40,54.39 39,55.39 C7.1 C6.1 ; 39,13.13 C10.1 39,16.19 40,17.2 v1(40,17.78) v1(40,18.54) 40,18.85 ; NOREF.1 40,81.98 39.01,82.97 39.01,86.15 C5.1 C4.1 ; C2.1 C3.1 ; 39.04,43.73 C8.1 39.04,48.25 40.02,49.23 40.02,52.03 ; 45.9,106.11 45.9,104.37
  vias: v1(3.75,102.99) v1(3.75,100.49) v1(3.75,87.49) v1(3.75,84.99) v1(3.75,75) v1(3.75,72.5) v1(3.75,59.5) v1(3.75,57) v1(3.75,131) v1(3.75,128.5) v1(3.75,115.5) v1(3.75,113) v1(3.75,47) v1(3.75,44.5) v1(3.75,31.5) v1(3.75,29) v1(3.75,18.99) v1(3.75,16.49) v1(3.75,3.49) v1(3.75,0.99) v1(5,129.75) v1(5,114.25) v1(5,101.74) v1(5,86.24) v1(5,73.75) v1(5,58.25) v1(5,45.75) v1(5,30.25) v1(5,17.74) v1(5,2.24) v1(6.25,102.99) v1(6.25,100.49) v1(6.25,87.49) v1(6.25,84.99) v1(6.25,75) v1(6.25,72.5) v1(6.25,59.5) v1(6.25,57) v1(6.25,131) v1(6.25,128.5) v1(6.25,115.5) v1(6.25,113) v1(6.25,47) v1(6.25,44.5) v1(6.25,31.5) v1(6.25,29) v1(6.25,18.99) v1(6.25,16.49) v1(6.25,3.49) v1(6.25,0.99) v1(12.69,36.56) v1(12.69,32.22) v1(12.89,120.57) v1(12.89,116.23) v1(13.08,92.57) v1(13.08,88.23) v1(13.08,64.57) v1(13.09,60.23) v1(13.08,8.57) v1(13.08,4.23) v1(21.32,36.56) v1(21.32,32.22) v1(21.51,120.57) v1(21.52,116.24) v1(21.71,92.57) v1(21.71,88.23) v1(21.71,64.57) v1(21.71,60.23) v1(21.71,8.57) v1(21.71,4.23) v1(25.5,131) v1(25.5,128.5) v1(25.5,115.5) v1(25.5,113) v1(25.5,102.99) v1(25.5,100.49) v1(25.5,87.49) v1(25.5,84.99) v1(25.5,75) v1(25.5,72.5) v1(25.5,59.5) v1(25.5,57) v1(25.5,47) v1(25.5,44.5) v1(25.5,31.5) v1(25.5,29) v1(25.5,18.99) v1(25.5,16.49) v1(25.5,3.49) v1(25.5,0.99) v1(26.75,101.74) v1(26.75,86.24) v1(26.75,73.75) v1(26.75,58.25) v1(26.75,129.75) v1(26.75,114.25) v1(26.75,45.75) v1(26.75,30.25) v1(26.75,17.74) v1(26.75,2.24) v1(28,131) v1(28,128.5) v1(28,115.5) v1(28,113) v1(28,102.99) v1(28,100.49) v1(28,87.49) v1(28,84.99) v1(28,75) v1(28,72.5) v1(28,59.5) v1(28,57) v1(28,47) v1(28,44.5) v1(28,31.5) v1(28,29) v1(28,18.99) v1(28,16.49) v1(28,3.49) v1(28,0.99) v1(30.71,123.66) v1(30.71,121.16) v1(31.96,122.41) v1(33.21,123.66) v1(33.21,121.16) v1(33.9,104.89) v1(34.98,114.64) v1(34.97,113.36) v1(34.97,112.09) v1(36.24,122.08) v1(36.24,120.09) v1(36.4,113.38) v1(37.39,110.18) v1(37.74,113.43) v1(38.4,123.79) v1(38.42,122.32) v1(38.4,110.19) v1(38.79,130.83) v1(38.79,128.33) v1(40.04,129.58) v1(40.71,112.47) v1(40.74,111.29) v1(41.29,130.83) v1(41.29,128.33) v1(41.64,123.81) v1(41.63,122.33) v1(43.81,122.11) v1(45.9,105.49) v1(45.93,104.49) v1(46.67,123.66) v1(46.67,121.16) v1(47.92,122.41) v1(49.17,123.66) v1(49.17,121.16) v1(52,131) v1(52,128.5) v1(52,115.5) v1(52,113) v1(52,103) v1(52,100.5) v1(52,87.5) v1(52,85) v1(52.01,74.98) v1(52.01,72.48) v1(52.01,59.48) v1(52.01,56.98) v1(52,46.98) v1(52,44.48) v1(52,31.49) v1(52,28.99) v1(52.01,18.99) v1(52.01,16.49) v1(52.01,3.49) v1(52.01,0.99) v1(53.25,129.75) v1(53.25,114.25) v1(53.25,101.75) v1(53.25,86.25) v1(53.25,45.73) v1(53.25,30.24) v1(53.26,73.73) v1(53.26,58.23) v1(53.26,17.74) v1(53.26,2.24) v1(54.5,131) v1(54.5,128.5) v1(54.5,115.5) v1(54.5,113) v1(54.5,103) v1(54.5,100.5) v1(54.5,87.5) v1(54.5,85) v1(54.51,74.98) v1(54.51,72.48) v1(54.51,59.48) v1(54.51,56.98) v1(54.5,46.98) v1(54.5,44.48) v1(54.5,31.49) v1(54.5,28.99) v1(54.51,18.99) v1(54.51,16.49) v1(54.51,3.49) v1(54.51,0.99) v1(58.48,120.56) v1(58.48,116.23) v1(58.48,92.56) v1(58.48,88.23) v1(58.48,64.56) v1(58.49,60.22) v1(58.48,36.56) v1(58.48,32.23) v1(58.48,8.57) v1(58.49,4.23) v1(67.11,120.57) v1(67.11,116.23) v1(67.11,92.56) v1(67.11,88.23) v1(67.12,64.56) v1(67.11,60.22) v1(67.11,36.57) v1(67.11,32.23) v1(67.12,8.57) v1(67.11,4.23) v1(73.75,131) v1(73.75,128.5) v1(73.75,115.5) v1(73.75,113) v1(73.75,46.98) v1(73.75,44.48) v1(73.75,31.49) v1(73.75,28.99) v1(73.75,103) v1(73.75,100.5) v1(73.75,87.5) v1(73.75,85) v1(73.76,74.98) v1(73.76,72.48) v1(73.76,59.48) v1(73.76,56.98) v1(73.76,18.99) v1(73.76,16.49) v1(73.76,3.49) v1(73.76,0.99) v1(75,129.75) v1(75,114.25) v1(75,101.75) v1(75,86.25) v1(75.01,73.73) v1(75.01,58.23) v1(75,45.73) v1(75,30.24) v1(75.01,17.74) v1(75.01,2.24) v1(76.25,131) v1(76.25,128.5) v1(76.25,115.5) v1(76.25,113) v1(76.25,103) v1(76.25,100.5) v1(76.25,87.5) v1(76.25,85) v1(76.25,46.98) v1(76.25,44.48) v1(76.25,31.49) v1(76.25,28.99) v1(76.26,74.98) v1(76.26,72.48) v1(76.26,59.48) v1(76.26,56.98) v1(76.26,18.99) v1(76.26,16.49) v1(76.26,3.49) v1(76.26,0.99)
PVBUS: length 303.6
  Top Layer w0.254: 54.34,10.47 54.34,5.62 54.36,5.6 ; 36.48,108.9 35.26,108.9 34.95,109.22 ; 25.72,35.13 25.72,38.32 25.85,38.44 25.9,38.49 ; 54.36,63.17 54.37,63.17 ; 54.4,66.56 54.35,66.52 54.35,63.17 ; 25.52,117.64 26.76,117.64 27.67,118.55 ; 25.64,119.21 26.22,119.21 26.72,119.7 26.73,119.71 ; 25.72,33.74 25.72,35.1 ; 54.43,119.1 53.78,119.74 53.78,119.84 ; 25.77,89.6 25.77,94.36 25.79,94.38 ; 25.74,10.18 25.74,7.4 25.74,7.4 25.74,5.6 ; 34.96,109.17 34.96,107.87 34.93,107.84 ; 54.26,117.57 53.3,117.57 52.46,118.41 ; 54.24,38.5 54.28,38.46 54.42,38.32 54.42,35.1 ; 54.45,91.02 54.42,90.99 54.42,89.8 54.41,89.79 ; 25.72,61.8 25.71,61.82 25.71,66.39 25.76,66.44 25.76,66.51 ; 37.39,117.92 38.62,117.92 ; 25.74,35.12 25.75,35.13 ; 38.34,115.03 38.48,115.18 38.48,115.89 38.74,116.14 38.85,116.14 ; 54.42,91.16 54.42,94.38 54.38,94.42 ; 54.39,33.64 54.39,35.05 ; 54.46,91.18 54.43,91.15 ; 54.33,61.66 54.33,63.14
  Top Layer w0.28: 62.85,65.34 64.05,64.14 PO6.A4 PO6.B9 ; 62.85,37.3 61.55,36 PO8.A9 61.55,33.41 ; 62.85,93.3 61.55,92 PO4.A9 61.55,89.42 ; 15.95,89.49 15.95,92.05 17.22,93.32 17.4,93.32 18.45,92.27 18.45,89.62 ; 18.45,33.62 18.45,36.27 17.4,37.32 17.22,37.32 15.95,36.05 15.95,33.49 ; 15.95,61.49 15.95,64.05 17.22,65.32 17.4,65.32 18.45,64.27 18.45,61.62 ; 64.05,117.41 PO2.A4 64.05,120.13 62.85,121.34 ; 62.85,93.34 64.05,92.14 PO4.A4 64.05,89.42 ; 64.05,33.41 PO8.A4 64.05,36.13 62.85,37.34 ; 18.45,5.62 18.45,8.27 17.4,9.32 17.22,9.32 15.95,8.05 PO9.A9 15.95,5.49 ; 62.85,65.31 61.55,64.01 PO6.A9 PO6.B4 ; PO1.B9 PO1.A4 18.45,120.07 17.2,121.32 15.95,120.07 PO1.A9 PO1.B4 ; 64.05,5.41 PO10.A4 64.05,8.13 62.85,9.34 ; 61.55,5.41 PO10.A9 61.55,8 62.85,9.3 ; 61.55,117.41 PO2.A9 61.55,120 62.85,121.3
  Top Layer w0.5: 31.12,38.44 17.83,38.44 17.3,37.91 17.3,37.44 ; 30.62,94.44 17.83,94.44 17.3,93.91 17.3,93.44 ; 49.78,10.46 62.08,10.46 62.85,9.7 62.85,9.34 ; 49.61,115.66 56.41,122.46 62.08,122.46 62.85,121.7 62.85,121.34 ; 62.85,65.34 62.85,65.7 62.08,66.47 49.78,66.47 ; 31.12,10.44 17.83,10.44 17.3,9.91 17.3,9.43 ; 62.85,37.34 62.85,37.7 62.08,38.46 49.78,38.46 ; 62.85,93.34 62.85,93.7 62.1,94.45 48.61,94.45 ; 31.12,66.44 17.83,66.44 17.3,65.91 17.3,65.43 ; 17.2,121.32 17.2,121.77 17.86,122.44 23.99,122.44 29.48,116.95 29.48,112.34 34.07,107.75 42.39,107.75
VBUS: length 7.5
  Top Layer w0.6: 42.43,125.13 42.43,121.37 ; 37.57,124.91 37.57,121.16
CC1: length 18.4
  Top Layer w0.254: v1(39.4,113.44) 39.39,113.45 U1.7 ; 41.25,125.13 41.25,124.35 41.05,124.15 41.05,123.83 ; v1(41.52,126.75) 41.52,126.57 41.25,126.31 41.25,125.44
  Bottom Layer w0.254: v1(41.52,126.75) 41.33,126.56 41.33,126.49 40.23,125.39 40.23,117.5 39.4,116.68 v1(39.4,113.44)
CC2: length 23.5
  Top Layer w0.254: 39.03,123.88 39.03,124.15 38.78,124.39 38.54,124.39 38.25,124.69 38.25,125.08 38.25,125.08 ; v1(40.4,113.44) 40.4,114.9 40.39,114.9 ; v1(38.25,126.73) 38.25,126.61 38.25,126.6 38.25,125.47 38.24,125.45
  Bottom Layer w0.254: v1(38.25,126.73) 38.27,126.73 38.87,127.33 41.76,127.33 42.1,126.99 42.1,126.51 40.58,124.99 40.58,117.36 39.76,116.53 39.76,113.91 40.23,113.44 v1(40.4,113.44)
CFG1: length 1.6
  Top Layer w0.254: 37.41,114.96 37.4,114.97 37.4,116.51 37.41,116.52
DN: length 24.1
  Top Layer w0.254: 40.54,123.85 40.54,124.45 ; 40.54,124.45 39.98,124.45 39.74,124.69 39.74,125.56 39.74,125.57 ; 40.54,124.45 40.57,124.45 40.75,124.63 40.75,126.73 v1(40.74,126.74) ; 40.54,124.45 40.54,124.45 ; v1(40.4,110.18) 40.4,108.91 40.39,108.9
  Bottom Layer w0.254: v1(40.4,110.18) 38.82,111.76 38.82,116.6 39.87,117.65 39.87,125.86 v1(40.74,126.74)
DP: length 23
  Top Layer w0.254: 39.55,123.85 39.55,124.29 39.27,124.57 39.27,124.96 ; 40.24,125.45 40.25,125.47 40.25,126.24 39.76,126.74 v1(39.75,126.74) 39.24,126.23 39.24,125.46 39.24,125.45 ; 39.39,108.9 39.39,110.17 v1(39.4,110.18)
  Bottom Layer w0.254: v1(39.75,126.74) 39.5,126.48 39.5,117.78 38.46,116.74 38.46,111.12 v1(39.4,110.18)
LED: length 2
  Top Layer w0.254: 38.96,4.92 38.96,2.93
PG: length 164.8
  Top Layer w0.254: 41.3,3.01 42.71,3.01 v1(42.72,3.02) ; 36.39,114.9 34.87,116.43 v1(34.87,116.44)
  Bottom Layer w0.254: v1(42.72,3.02) 41.35,1.66 14.29,1.66 11.05,4.9 11.05,103.22 24.32,116.48 34.83,116.48 v1(34.87,116.44)
$1N16517: length 9
  Top Layer w0.254: 23.92,117.61 23.2,117.61 v1(23.19,117.6) ; 16.45,117.44 16.45,118.3 v1(16.55,118.39)
  Bottom Layer w0.254: v1(23.19,117.6) 22.83,117.24 17.7,117.24 v1(16.55,118.39)
$1N16677: length 8.6
  Top Layer w0.254: v1(17.85,118.41) 17.87,118.41 17.96,118.5 17.96,119.37 ; 23.97,119.17 23.26,119.17 v1(23.22,119.21)
  Bottom Layer w0.254: v1(17.85,118.41) 18.67,117.6 22.36,117.6 23.22,118.45 v1(23.22,119.21)
$1N16819: length 9
  Top Layer w0.254: v1(63.45,118.41) 63.55,118.5 63.55,119.29 63.54,119.29 ; 55.99,119.18 57.06,119.18 v1(57.07,119.19)
  Bottom Layer w0.254: v1(63.45,118.41) 62.29,119.57 57.48,119.57 57.1,119.19 v1(57.07,119.19)
$1N16821: length 8.5
  Top Layer w0.254: v1(57.08,117.61) 56.1,117.61 56.07,117.64 ; 62.04,117.44 62.05,117.45 62.05,118.21 62.15,118.31 v1(62.15,118.39)
  Bottom Layer w0.254: v1(62.15,118.39) 61.33,119.21 57.92,119.21 57.08,118.37 v1(57.08,117.61)
$1N16918: length 9
  Top Layer w0.254: 24.19,91.14 23.22,91.14 v1(23.21,91.15) ; 17.94,91.4 17.94,90.49 17.86,90.41 v1(17.86,90.41)
  Bottom Layer w0.254: v1(23.21,91.15) 23.21,90.43 22.12,89.34 18.93,89.34 v1(17.86,90.41)
$1N16920: length 9.6
  Top Layer w0.254: v1(16.55,90.39) 16.45,90.3 16.45,89.43 16.45,89.43 ; 24.21,89.58 23.23,89.58 v1(23.21,89.6)
  Bottom Layer w0.254: v1(16.55,90.39) 18.01,88.93 22.54,88.93 v1(23.21,89.6)
$1N17013: length 9.2
  Top Layer w0.254: v1(56.98,91.15) 56.01,91.15 55.96,91.2 ; 63.55,91.19 63.55,90.5 v1(63.45,90.41)
  Bottom Layer w0.254: v1(63.45,90.41) 61.98,91.88 57.71,91.88 v1(56.98,91.15)
$1N17015: length 8.8
  Top Layer w0.254: v1(56.97,89.68) 56.96,89.67 55.93,89.67 ; v1(62.15,90.39) 62.14,90.39 62.05,90.3 62.05,89.43 62.06,89.42
  Bottom Layer w0.254: v1(62.15,90.39) 61.01,91.53 58.24,91.53 56.97,90.26 v1(56.97,89.68)
$1N17112: length 9
  Top Layer w0.254: v1(23.19,63.25) 24.19,63.25 24.2,63.24 ; v1(17.85,62.41) 17.95,62.5 17.95,63.3
  Bottom Layer w0.254: v1(17.85,62.41) 17.87,62.41 19.08,61.19 21.77,61.19 23.19,62.61 v1(23.19,63.25)
$1N17114: length 9.7
  Top Layer w0.254: 24.22,61.71 23.21,61.71 v1(23.2,61.7) ; v1(16.54,62.39) 16.5,62.39 16.46,62.35 16.46,61.43
  Bottom Layer w0.254: v1(16.54,62.39) 16.56,62.39 18.12,60.84 22.33,60.84 v1(23.2,61.7)
$1N17209: length 9.2
  Top Layer w0.254: v1(57,63.19) 56.93,63.13 56.02,63.13 ; v1(63.45,62.41) 63.46,62.41 63.55,62.5 63.55,63.25
  Bottom Layer w0.254: v1(63.45,62.41) 61.97,63.89 57.69,63.89 v1(57,63.19)
$1N17211: length 8.9
  Top Layer w0.254: 55.97,61.65 v1(57,61.65) ; 62.06,61.39 62.06,62.31 62.14,62.39 v1(62.15,62.39)
  Bottom Layer w0.254: v1(57,61.65) 57,62.37 58.16,63.53 61.01,63.53 v1(62.15,62.39)
$1N17310: length 9
  Top Layer w0.254: v1(23.1,35.18) 23.12,35.16 24.12,35.16 ; v1(17.86,34.41) 17.95,34.51 17.95,35.38
  Bottom Layer w0.254: v1(23.1,35.18) 23.1,34.48 21.9,33.28 18.98,33.28 v1(17.86,34.41)
$1N17312: length 9.4
  Top Layer w0.254: v1(16.55,34.39) 16.47,34.32 16.47,34.15 16.46,34.14 16.46,33.55 ; v1(23.09,33.63) 23.1,33.62 24.2,33.62
  Bottom Layer w0.254: v1(16.55,34.39) 18.01,32.93 22.38,32.93 v1(23.09,33.63)
$1N17405: length 9.3
  Top Layer w0.254: 56.01,35.17 57.02,35.17 v1(57.03,35.18) ; 63.55,35.35 63.55,34.51 63.51,34.47
  Bottom Layer w0.254: v1(57.03,35.18) 57.82,35.96 61.9,35.96 v1(63.45,34.41)
$1N17407: length 9
  Top Layer w0.254: 62.14,34.38 62.06,34.29 62.06,33.43 ; 55.94,33.56 57.01,33.56 v1(57.02,33.57)
  Bottom Layer w0.254: 62.15,34.43 60.98,35.61 58.3,35.61 57.02,34.32 v1(57.02,33.57)
  vias: v1(62.15,34.39)
$1N17504: length 8.7
  Top Layer w0.254: 17.96,6.53 17.96,7.13 17.95,7.13 ; 24.2,7.16 v1(23.19,7.16)
  Bottom Layer w0.254: v1(17.86,6.41) 17.86,6.31 18.97,5.2 21.84,5.2 23.19,6.54 v1(23.19,7.16)
$1N17506: length 9.7
  Top Layer w0.254: 16.44,5.3 16.44,6.29 v1(16.55,6.39) ; 24.12,5.66 v1(23.24,5.66)
  Bottom Layer w0.254: v1(16.55,6.39) 16.56,6.39 18.11,4.84 22.42,4.84 v1(23.24,5.66)
$1N17599: length 9.4
  Top Layer w0.254: v1(63.45,6.41) 63.55,6.5 63.55,7.34 ; v1(57.05,7.12) 57.04,7.11 56.02,7.11
  Bottom Layer w0.254: v1(63.45,6.41) 61.88,7.98 57.91,7.98 v1(57.05,7.12)
$1N17601: length 9
  Top Layer w0.254: v1(62.15,6.39) 62.05,6.3 62.05,5.39 ; 55.95,5.58 v1(57.04,5.58)
  Bottom Layer w0.254: v1(57.04,5.58) 57.04,6.23 58.44,7.63 60.93,7.63 62.15,6.41 v1(62.15,6.39)

## Copper pours and planes (outline as drawn; the poured copper is in the pictures)
GND on Top Layer: 0,127 0.01,127.34 0.06,127.78 0.15,128.22 0.28,128.65 0.45,129.07 0.65,129.47 0.89,129.85 1.16,130.2 1.46,130.54 1.8,130.84 2.15,131.11 2.53,131.35 2.93,131.55 3.35,131.72 3.78,131.85 4.22,131.94 4.66,131.99 5,132 75,132 75.34,131.99 75.78,131.94 76.22,131.85 76.65,131.72 77.07,131.55 77.47,131.35 77.85,131.11 78.2,130.84 78.54,130.54 78.84,130.2 79.11,129.85 79.35,129.47 79.55,129.07 79.72,128.65 79.85,128.22 79.94,127.78 79.99,127.34 80,127 80,5 79.99,4.66 79.94,4.22 79.85,3.78 79.72,3.35 79.55,2.93 79.35,2.53 79.11,2.15 78.84,1.8 78.54,1.46 78.2,1.16 77.85,0.89 77.47,0.65 77.07,0.45 76.65,0.28 76.22,0.15 75.78,0.06 75.34,0.01 75,0 5,0 4.66,0.01 4.22,0.06 3.78,0.15 3.35,0.28 2.93,0.45 2.53,0.65 2.15,0.89 1.8,1.16 1.46,1.46 1.16,1.8 0.89,2.15 0.65,2.53 0.45,2.93 0.28,3.35 0.15,3.78 0.06,4.22 0.01,4.66 0,5
GND on Bottom Layer: 0,127 0.01,127.34 0.06,127.78 0.15,128.22 0.28,128.65 0.45,129.07 0.65,129.47 0.89,129.85 1.16,130.2 1.46,130.54 1.8,130.84 2.15,131.11 2.53,131.35 2.93,131.55 3.35,131.72 3.78,131.85 4.22,131.94 4.66,131.99 5,132 75,132 75.34,131.99 75.78,131.94 76.22,131.85 76.65,131.72 77.07,131.55 77.47,131.35 77.85,131.11 78.2,130.84 78.54,130.54 78.84,130.2 79.11,129.85 79.35,129.47 79.55,129.07 79.72,128.65 79.85,128.22 79.94,127.78 79.99,127.34 80,127 80,5 79.99,4.66 79.94,4.22 79.85,3.78 79.72,3.35 79.55,2.93 79.35,2.53 79.11,2.15 78.84,1.8 78.54,1.46 78.2,1.16 77.85,0.89 77.47,0.65 77.07,0.45 76.65,0.28 76.22,0.15 75.78,0.06 75.34,0.01 75,0 5,0 4.66,0.01 4.22,0.06 3.78,0.15 3.35,0.28 2.93,0.45 2.53,0.65 2.15,0.89 1.8,1.16 1.46,1.46 1.16,1.8 0.89,2.15 0.65,2.53 0.45,2.93 0.28,3.35 0.15,3.78 0.06,4.22 0.01,4.66 0,5
PVBUS on Top Layer: 38.28,119.09 38.23,114.77 41.39,112.96 41.39,102.03 29.71,95.14 29.72,8.7 33.32,5.12 46.53,5.13 50.55,8.45 50.55,115.5 46.99,119.09
VBUS on Top Layer: 37.24,121.75 37.25,119.59 37.67,119.25 42.02,119.23 42.78,119.65 42.77,120.91 42.76,121.74

## Text on the board
Bottom Silkscreen Layer: THE GAME | "you are beautiful, you are loved, | you are cared about exactly as you are" | ❤️puppy sky❤️ | :3
Top Solder Mask Layer: p.s. ur cute <3
Top Silkscreen Layer: OPENPAWLABS.COM | Charging Dock | 10 Trackerz | 4 | 5 | 3 | 9 | 7 | 1 | 10 | 8 | 6 | 2
